# EAGLE schematic experimenter (EAGLE 9.6.2), part 2 of 2
## Sheet 1 of 2: NMOS Array (continued)
### Nets (continued)
N$308: JP69.2 R83.1
N$309: JN69.2 JS69.2 Q77.2(S) SOURCEA69.P1(S) SOURCEB69.P1(S)
N$311: DRAINA69.P1(S) DRAINB69.P1(S) JD68.1 JD69.2 JP69.1 JS85.1 Q77.3(D)
N$312: GATEA69.P1(S) GATEB69.P1(S) Q77.1(G)
N$313: JP70.2 R84.1
N$314: JN70.2 JS70.2 Q78.2(S) SOURCEA70.P1(S) SOURCEB70.P1(S)
N$315: DRAINA70.P1(S) DRAINB70.P1(S) JD69.1 JD70.2 JP70.1 JS86.1 Q78.3(D)
N$316: GATEA70.P1(S) GATEB70.P1(S) Q78.1(G)
N$317: JP71.2 R87.1
N$318: JN71.2 JS71.2 Q79.2(S) SOURCEA71.P1(S) SOURCEB71.P1(S)
N$319: DRAINA71.P1(S) DRAINB71.P1(S) JD70.1 JD71.2 JP71.1 JS87.1 Q79.3(D)
N$320: GATEA71.P1(S) GATEB71.P1(S) Q79.1(G)
N$323: JP72.2 R88.1
N$324: JN72.2 JS72.2 Q80.2(S) SOURCEA72.P1(S) SOURCEB72.P1(S)
N$325: DRAINA72.P1(S) DRAINB72.P1(S) JD71.1 JD72.2 JP72.1 JS88.1 Q80.3(D)
N$326: GATEA72.P1(S) GATEB72.P1(S) Q80.1(G)
N$327: JP73.2 R91.1
N$328: JN73.2 JS73.2 Q81.2(S) SOURCEA73.P1(S) SOURCEB73.P1(S)
N$329: DRAINA73.P1(S) DRAINB73.P1(S) JD72.1 JD73.2 JP73.1 JS89.1 Q81.3(D)
N$330: GATEA73.P1(S) GATEB73.P1(S) Q81.1(G)
N$331: JP74.2 R92.1
N$332: JN74.2 JS74.2 Q82.2(S) SOURCEA74.P1(S) SOURCEB74.P1(S)
N$333: DRAINA74.P1(S) DRAINB74.P1(S) JD73.1 JD74.2 JP74.1 JS90.1 Q82.3(D)
N$334: GATEA74.P1(S) GATEB74.P1(S) Q82.1(G)
N$335: JP75.2 R95.1
N$336: JN75.2 JS75.2 Q83.2(S) SOURCEA75.P1(S) SOURCEB75.P1(S)
N$337: DRAINA75.P1(S) DRAINB75.P1(S) JD74.1 JD75.2 JP75.1 JS91.1 Q83.3(D)
N$338: GATEA75.P1(S) GATEB75.P1(S) Q83.1(G)
N$339: JP76.2 R96.1
N$340: JN76.2 JS76.2 Q84.2(S) SOURCEA76.P1(S) SOURCEB76.P1(S)
N$341: DRAINA76.P1(S) DRAINB76.P1(S) JD75.1 JD76.2 JP76.1 JS92.1 Q84.3(D)
N$342: GATEA76.P1(S) GATEB76.P1(S) Q84.1(G)
N$343: JP77.2 R97.1
N$344: JN77.2 JS77.2 Q85.2(S) SOURCEA77.P1(S) SOURCEB77.P1(S)
N$345: DRAINA77.P1(S) DRAINB77.P1(S) JD76.1 JD77.2 JP77.1 JS93.1 Q85.3(D)
N$346: GATEA77.P1(S) GATEB77.P1(S) Q85.1(G)
N$347: JP78.2 R98.1
N$348: JN78.2 JS78.2 Q86.2(S) SOURCEA78.P1(S) SOURCEB78.P1(S)
N$349: DRAINA78.P1(S) DRAINB78.P1(S) JD77.1 JD78.2 JP78.1 JS94.1 Q86.3(D)
N$350: GATEA78.P1(S) GATEB78.P1(S) Q86.1(G)
N$351: JP79.2 R99.1
N$352: JN79.2 JS79.2 Q87.2(S) SOURCEA79.P1(S) SOURCEB79.P1(S)
N$353: DRAINA79.P1(S) DRAINB79.P1(S) JD78.1 JD79.2 JP79.1 JS95.1 Q87.3(D)
N$354: GATEA79.P1(S) GATEB79.P1(S) Q87.1(G)
N$355: JP80.2 R100.1
N$356: JN80.2 JS80.2 Q88.2(S) SOURCEA80.P1(S) SOURCEB80.P1(S)
N$357: DRAINA80.P1(S) DRAINB80.P1(S) JD79.1 JD80.2 JP80.1 JS96.1 Q88.3(D)
N$358: GATEA80.P1(S) GATEB80.P1(S) Q88.1(G)
N$359: JP81.2 R101.1
N$360: JN81.2 JS81.2 Q89.2(S) SOURCEA81.P1(S) SOURCEB81.P1(S)
N$361: DRAINA81.P1(S) DRAINB81.P1(S) JD81.2 JP81.1 JS97.1 Q89.3(D)
N$362: GATEA81.P1(S) GATEB81.P1(S) Q89.1(G)
N$363: JP82.2 R102.1
N$364: JN82.2 JS82.2 Q90.2(S) SOURCEA82.P1(S) SOURCEB82.P1(S)
N$365: DRAINA82.P1(S) DRAINB82.P1(S) JD81.1 JD82.2 JP82.1 JS98.1 Q90.3(D)
N$366: GATEA82.P1(S) GATEB82.P1(S) Q90.1(G)
N$367: JP83.2 R103.1
N$368: JN83.2 JS83.2 Q91.2(S) SOURCEA83.P1(S) SOURCEB83.P1(S)
N$369: DRAINA83.P1(S) DRAINB83.P1(S) JD82.1 JD83.2 JP83.1 JS99.1 Q91.3(D)
N$370: GATEA83.P1(S) GATEB83.P1(S) Q91.1(G)
N$371: JP84.2 R104.1
N$372: JN84.2 JS84.2 Q92.2(S) SOURCEA84.P1(S) SOURCEB84.P1(S)
N$373: DRAINA84.P1(S) DRAINB84.P1(S) JD83.1 JD84.2 JP84.1 JS100.1 Q92.3(D)
N$374: GATEA84.P1(S) GATEB84.P1(S) Q92.1(G)
N$375: JP85.2 R105.1
N$376: JN85.2 JS85.2 Q93.2(S) SOURCEA85.P1(S) SOURCEB85.P1(S)
N$377: DRAINA85.P1(S) DRAINB85.P1(S) JD84.1 JD85.2 JP85.1 JS101.1 Q93.3(D)
N$378: GATEA85.P1(S) GATEB85.P1(S) Q93.1(G)
N$379: JP86.2 R106.1
N$380: JN86.2 JS86.2 Q94.2(S) SOURCEA86.P1(S) SOURCEB86.P1(S)
N$381: DRAINA86.P1(S) DRAINB86.P1(S) JD85.1 JD86.2 JP86.1 JS102.1 Q94.3(D)
N$382: GATEA86.P1(S) GATEB86.P1(S) Q94.1(G)
N$383: JP87.2 R107.1
N$384: JN87.2 JS87.2 Q95.2(S) SOURCEA87.P1(S) SOURCEB87.P1(S)
N$385: DRAINA87.P1(S) DRAINB87.P1(S) JD86.1 JD87.2 JP87.1 JS103.1 Q95.3(D)
N$386: GATEA87.P1(S) GATEB87.P1(S) Q95.1(G)
N$387: JP88.2 R108.1
N$388: JN88.2 JS88.2 Q96.2(S) SOURCEA88.P1(S) SOURCEB88.P1(S)
N$389: DRAINA88.P1(S) DRAINB88.P1(S) JD87.1 JD88.2 JP88.1 JS104.1 Q96.3(D)
N$390: GATEA88.P1(S) GATEB88.P1(S) Q96.1(G)
N$391: JP89.2 R109.1
N$392: JN89.2 JS89.2 Q97.2(S) SOURCEA89.P1(S) SOURCEB89.P1(S)
N$393: DRAINA89.P1(S) DRAINB89.P1(S) JD88.1 JD89.2 JP89.1 JS105.1 Q97.3(D)
N$394: GATEA89.P1(S) GATEB89.P1(S) Q97.1(G)
N$395: JP90.2 R110.1
N$396: JN90.2 JS90.2 Q98.2(S) SOURCEA90.P1(S) SOURCEB90.P1(S)
N$397: DRAINA90.P1(S) DRAINB90.P1(S) JD89.1 JD90.2 JP90.1 JS106.1 Q98.3(D)
N$398: GATEA90.P1(S) GATEB90.P1(S) Q98.1(G)
N$399: JP91.2 R111.1
N$400: JN91.2 JS91.2 Q99.2(S) SOURCEA91.P1(S) SOURCEB91.P1(S)
N$401: DRAINA91.P1(S) DRAINB91.P1(S) JD90.1 JD91.2 JP91.1 JS107.1 Q99.3(D)
N$402: GATEA91.P1(S) GATEB91.P1(S) Q99.1(G)
N$403: JP92.2 R112.1
N$404: JN92.2 JS92.2 Q100.2(S) SOURCEA92.P1(S) SOURCEB92.P1(S)
N$405: DRAINA92.P1(S) DRAINB92.P1(S) JD91.1 JD92.2 JP92.1 JS108.1 Q100.3(D)
N$406: GATEA92.P1(S) GATEB92.P1(S) Q100.1(G)
N$407: JP93.2 R113.1
N$408: JN93.2 JS93.2 Q101.2(S) SOURCEA93.P1(S) SOURCEB93.P1(S)
N$409: DRAINA93.P1(S) DRAINB93.P1(S) JD92.1 JD93.2 JP93.1 JS109.1 Q101.3(D)
N$410: GATEA93.P1(S) GATEB93.P1(S) Q101.1(G)
N$411: JP94.2 R114.1
N$412: JN94.2 JS94.2 Q102.2(S) SOURCEA94.P1(S) SOURCEB94.P1(S)
N$413: DRAINA94.P1(S) DRAINB94.P1(S) JD93.1 JD94.2 JP94.1 JS110.1 Q102.3(D)
N$414: GATEA94.P1(S) GATEB94.P1(S) Q102.1(G)
N$415: JP95.2 R115.1
N$416: JN95.2 JS95.2 Q103.2(S) SOURCEA95.P1(S) SOURCEB95.P1(S)
N$417: DRAINA95.P1(S) DRAINB95.P1(S) JD94.1 JD95.2 JP95.1 JS111.1 Q103.3(D)
N$418: GATEA95.P1(S) GATEB95.P1(S) Q103.1(G)
N$419: JP96.2 R116.1
N$420: JN96.2 JS96.2 Q104.2(S) SOURCEA96.P1(S) SOURCEB96.P1(S)
N$421: DRAINA96.P1(S) DRAINB96.P1(S) JD95.1 JD96.2 JP96.1 JS112.1 Q104.3(D)
N$422: GATEA96.P1(S) GATEB96.P1(S) Q104.1(G)
N$423: JP97.2 R117.1
N$424: JN97.2 JS97.2 Q105.2(S) SOURCEA97.P1(S) SOURCEB97.P1(S)
N$425: DRAINA97.P1(S) DRAINB97.P1(S) JD97.2 JP97.1 Q105.3(D)
N$426: GATEA97.P1(S) GATEB97.P1(S) Q105.1(G)
N$427: JP98.2 R118.1
N$428: JN98.2 JS98.2 Q106.2(S) SOURCEA98.P1(S) SOURCEB98.P1(S)
N$429: DRAINA98.P1(S) DRAINB98.P1(S) JD97.1 JD98.2 JP98.1 Q106.3(D)
N$430: GATEA98.P1(S) GATEB98.P1(S) Q106.1(G)
N$431: JP99.2 R119.1
N$432: JN99.2 JS99.2 Q107.2(S) SOURCEA99.P1(S) SOURCEB99.P1(S)
N$433: DRAINA99.P1(S) DRAINB99.P1(S) JD98.1 JD99.2 JP99.1 Q107.3(D)
N$434: GATEA99.P1(S) GATEB99.P1(S) Q107.1(G)
N$435: JP100.2 R120.1
N$436: JN100.2 JS100.2 Q108.2(S) SOURCEA100.P1(S) SOURCEB100.P1(S)
N$437: DRAINA100.P1(S) DRAINB100.P1(S) JD99.1 JD100.2 JP100.1 Q108.3(D)
N$438: GATEA100.P1(S) GATEB100.P1(S) Q108.1(G)
N$439: JP101.2 R121.1
N$440: JN101.2 JS101.2 Q109.2(S) SOURCEA101.P1(S) SOURCEB101.P1(S)
N$441: DRAINA101.P1(S) DRAINB101.P1(S) JD100.1 JD101.2 JP101.1 Q109.3(D)
N$442: GATEA101.P1(S) GATEB101.P1(S) Q109.1(G)
N$443: JP102.2 R122.1
N$444: JN102.2 JS102.2 Q110.2(S) SOURCEA102.P1(S) SOURCEB102.P1(S)
N$445: DRAINA102.P1(S) DRAINB102.P1(S) JD101.1 JD102.2 JP102.1 Q110.3(D)
N$446: GATEA102.P1(S) GATEB102.P1(S) Q110.1(G)
N$447: JP103.2 R123.1
N$448: JN103.2 JS103.2 Q111.2(S) SOURCEA103.P1(S) SOURCEB103.P1(S)
N$449: DRAINA103.P1(S) DRAINB103.P1(S) JD102.1 JD103.2 JP103.1 Q111.3(D)
N$450: GATEA103.P1(S) GATEB103.P1(S) Q111.1(G)
N$451: JP104.2 R124.1
N$452: JN104.2 JS104.2 Q112.2(S) SOURCEA104.P1(S) SOURCEB104.P1(S)
N$453: DRAINA104.P1(S) DRAINB104.P1(S) JD103.1 JD104.2 JP104.1 Q112.3(D)
N$454: GATEA104.P1(S) GATEB104.P1(S) Q112.1(G)
N$455: JP105.2 R125.1
N$456: JN105.2 JS105.2 Q113.2(S) SOURCEA105.P1(S) SOURCEB105.P1(S)
N$457: DRAINA105.P1(S) DRAINB105.P1(S) JD104.1 JD105.2 JP105.1 Q113.3(D)
N$458: GATEA105.P1(S) GATEB105.P1(S) Q113.1(G)
N$459: JP106.2 R126.1
N$460: JN106.2 JS106.2 Q114.2(S) SOURCEA106.P1(S) SOURCEB106.P1(S)
N$461: DRAINA106.P1(S) DRAINB106.P1(S) JD105.1 JD106.2 JP106.1 Q114.3(D)
N$462: GATEA106.P1(S) GATEB106.P1(S) Q114.1(G)
N$463: JP107.2 R127.1
N$464: JN107.2 JS107.2 Q115.2(S) SOURCEA107.P1(S) SOURCEB107.P1(S)
N$465: DRAINA107.P1(S) DRAINB107.P1(S) JD106.1 JD107.2 JP107.1 Q115.3(D)
N$466: GATEA107.P1(S) GATEB107.P1(S) Q115.1(G)
N$467: JP108.2 R128.1
N$468: JN108.2 JS108.2 Q116.2(S) SOURCEA108.P1(S) SOURCEB108.P1(S)
N$469: DRAINA108.P1(S) DRAINB108.P1(S) JD107.1 JD108.2 JP108.1 Q116.3(D)
N$470: GATEA108.P1(S) GATEB108.P1(S) Q116.1(G)
N$471: JP109.2 R129.1
N$472: JN109.2 JS109.2 Q117.2(S) SOURCEA109.P1(S) SOURCEB109.P1(S)
N$473: DRAINA109.P1(S) DRAINB109.P1(S) JD108.1 JD109.2 JP109.1 Q117.3(D)
N$474: GATEA109.P1(S) GATEB109.P1(S) Q117.1(G)
N$475: JP110.2 R130.1
N$476: JN110.2 JS110.2 Q118.2(S) SOURCEA110.P1(S) SOURCEB110.P1(S)
N$477: DRAINA110.P1(S) DRAINB110.P1(S) JD109.1 JD110.2 JP110.1 Q118.3(D)
N$478: GATEA110.P1(S) GATEB110.P1(S) Q118.1(G)
N$479: JP111.2 R131.1
N$480: JN111.2 JS111.2 Q119.2(S) SOURCEA111.P1(S) SOURCEB111.P1(S)
N$481: DRAINA111.P1(S) DRAINB111.P1(S) JD110.1 JD111.2 JP111.1 Q119.3(D)
N$482: GATEA111.P1(S) GATEB111.P1(S) Q119.1(G)
N$483: JP112.2 R132.1
N$484: JN112.2 JS112.2 Q120.2(S) SOURCEA112.P1(S) SOURCEB112.P1(S)
N$485: DRAINA112.P1(S) DRAINB112.P1(S) JD111.1 JD112.2 JP112.1 Q120.3(D)
N$486: GATEA112.P1(S) GATEB112.P1(S) Q120.1(G)
VCC: R25.2 R26.2 R27.2 R28.2 R29.2 R30.2 R31.2 R32.2 R33.2 R34.2 R35.2 R36.2 R37.2 R38.2 R39.2 R40.2 R41.2 R42.2 R43.2 R44.2 R45.2 R46.2 R47.2 R48.2 R49.2 R50.2 R51.2 R52.2 R53.2 R54.2 R55.2 R56.2 R57.2 R58.2 R59.2 R60.2 R61.2 R62.2 R63.2 R64.2 R65.2 R66.2 R67.2 R68.2 R69.2 R70.2 R71.2 R72.2 R73.2 R74.2 R79.2 R80.2 R83.2 R84.2 R87.2 R88.2 R91.2 R92.2 R95.2 R96.2 R97.2 R98.2 R99.2 R100.2 R101.2 R102.2 R103.2 R104.2 R105.2 R106.2 R107.2 R108.2 R109.2 R110.2 R111.2 R112.2 R113.2 R114.2 R115.2 R116.2 R117.2 R118.2 R119.2 R120.2 R121.2 R122.2 R123.2 R124.2 R125.2 R126.2 R127.2 R128.2 R129.2 R130.2 R131.2 R132.2 ; also sheet 2
Unconnected: JD32.1 JD48.1 JD64.1 JD80.1 JD96.1 JD112.1 JS33.1 JS34.1 JS35.1 JS36.1 JS37.1 JS38.1 JS39.1 JS40.1 JS41.1 JS42.1 JS43.1 JS44.1 JS45.1 JS46.1 JS47.1 JS48.1

### Notes on the sheet
- NMOS Logic
  Transistor Cell
- NMOS Logic
  Transistor Cell
- NMOS Logic
  Transistor Cell
- NMOS Logic
  Transistor Cell
- NMOS Logic
  Transistor Cell
- NMOS Logic
  Transistor Cell
- NMOS Logic
  Transistor Cell
- NMOS Logic
  Transistor Cell
- NMOS Logic
  Transistor Cell
- NMOS Logic
  Transistor Cell
- NMOS Logic
  Transistor Cell
- NMOS Logic
  Transistor Cell
- NMOS Logic
  Transistor Cell
- NMOS Logic
  Transistor Cell
- NMOS Logic
  Transistor Cell
- NMOS Logic
  Transistor Cell
- NMOS Logic
  Transistor Cell
- NMOS Logic
  Transistor Cell
- NMOS Logic
  Transistor Cell
- NMOS Logic
  Transistor Cell
- NMOS Logic
  Transistor Cell
- NMOS Logic
  Transistor Cell
- NMOS Logic
  Transistor Cell
- NMOS Logic
  Transistor Cell
- NMOS Logic
  Transistor Cell
- NMOS Logic
  Transistor Cell
- NMOS Logic
  Transistor Cell
- NMOS Logic
  Transistor Cell
- NMOS Logic
  Transistor Cell
- NMOS Logic
  Transistor Cell
- NMOS Logic
  Transistor Cell
- NMOS Logic
  Transistor Cell
- NMOS Logic
  Transistor Cell
- NMOS Logic
  Transistor Cell
- NMOS Logic
  Transistor Cell
- NMOS Logic
  Transistor Cell
- NMOS Logic
  Transistor Cell
- NMOS Logic
  Transistor Cell
- NMOS Logic
  Transistor Cell
- NMOS Logic
  Transistor Cell
- NMOS Logic
  Transistor Cell
- NMOS Logic
  Transistor Cell
- NMOS Logic
  Transistor Cell
- NMOS Logic
  Transistor Cell
- NMOS Logic
  Transistor Cell
- NMOS Logic
  Transistor Cell
- NMOS Logic
  Transistor Cell
- NMOS Logic
  Transistor Cell
- NMOS Logic
  Transistor Cell
- NMOS Logic
  Transistor Cell
- NMOS Logic
  Transistor Cell
- NMOS Logic
  Transistor Cell
- NMOS Logic
  Transistor Cell
- NMOS Logic
  Transistor Cell
- NMOS Logic
  Transistor Cell
- NMOS Logic
  Transistor Cell
- NMOS Logic
  Transistor Cell
- NMOS Logic
  Transistor Cell
- NMOS Logic
  Transistor Cell
- NMOS Logic
  Transistor Cell
- NMOS Logic
  Transistor Cell
- NMOS Logic
  Transistor Cell
- NMOS Logic
  Transistor Cell
- NMOS Logic
  Transistor Cell
- NMOS Logic
  Transistor Cell
- NMOS Logic
  Transistor Cell
- NMOS Logic
  Transistor Cell
- NMOS Logic
  Transistor Cell
- NMOS Logic
  Transistor Cell
- NMOS Logic
  Transistor Cell
- NMOS Logic
  Transistor Cell
- NMOS Logic
  Transistor Cell
- NMOS Logic
  Transistor Cell
- NMOS Logic
  Transistor Cell
- NMOS Logic
  Transistor Cell
- NMOS Logic
  Transistor Cell
- NMOS Logic
  Transistor Cell
- NMOS Logic
  Transistor Cell
- NMOS Logic
  Transistor Cell
- NMOS Logic
  Transistor Cell
- NMOS Logic
  Transistor Cell
- NMOS Logic
  Transistor Cell
- NMOS Logic
  Transistor Cell
- NMOS Logic
  Transistor Cell
- NMOS Logic
  Transistor Cell
- NMOS Logic
  Transistor Cell
- NMOS Logic
  Transistor Cell
- NMOS Logic
  Transistor Cell
- NMOS Logic
  Transistor Cell
- NMOS Logic
  Transistor Cell
- NMOS Logic
  Transistor Cell
- NMOS Logic
  Transistor Cell
- NMOS Logic
  Transistor Cell
- NMOS Logic
  Transistor Cell
- NMOS Logic
  Transistor Cell
- NMOS Logic
  Transistor Cell

## Sheet 2 of 2: Buttons, Switches, LEDs, Power
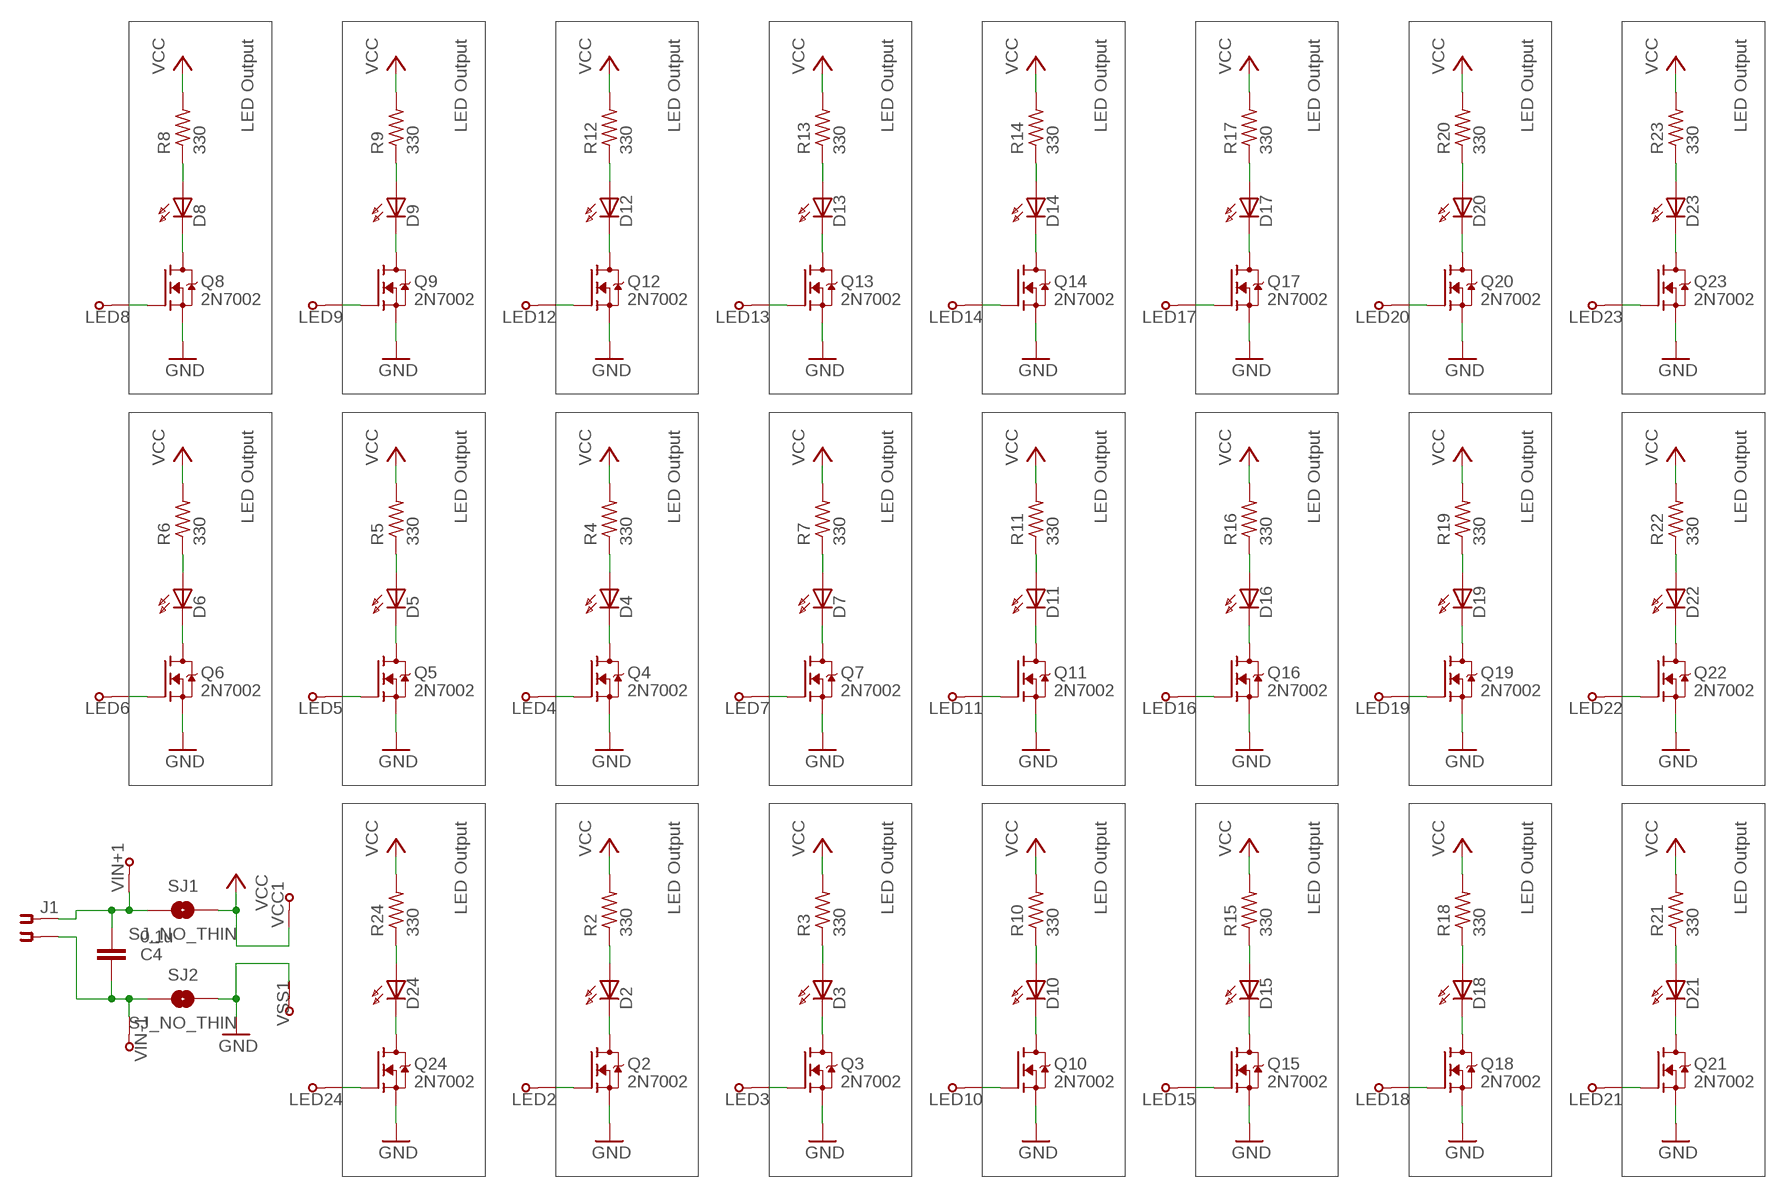
[diagram p2: schematic, sheet 2]

### Parts
C4  0.1u  CAP0603  [C0603]
D2  LED0603  [CHIP-LED0603]
D3  LED0603  [CHIP-LED0603]
D4  LED0603  [CHIP-LED0603]
D5  LED0603  [CHIP-LED0603]
D6  LED0603  [CHIP-LED0603]
D7  LED0603  [CHIP-LED0603]
D8  LED0603  [CHIP-LED0603]
D9  LED0603  [CHIP-LED0603]
D10  LED0603  [CHIP-LED0603]
D11  LED0603  [CHIP-LED0603]
D12  LED0603  [CHIP-LED0603]
D13  LED0603  [CHIP-LED0603]
D14  LED0603  [CHIP-LED0603]
D15  LED0603  [CHIP-LED0603]
D16  LED0603  [CHIP-LED0603]
D17  LED0603  [CHIP-LED0603]
D18  LED0603  [CHIP-LED0603]
D19  LED0603  [CHIP-LED0603]
D20  LED0603  [CHIP-LED0603]
D21  LED0603  [CHIP-LED0603]
D22  LED0603  [CHIP-LED0603]
D23  LED0603  [CHIP-LED0603]
D24  LED0603  [CHIP-LED0603]
J1  CON-F-2SCREWTERM-0.1"  [OSTVN02A150]
LED2  TPTHT  [PROTOPAD-THT-PAD]
LED3  TPTHT  [PROTOPAD-THT-PAD]
LED4  TPTHT  [PROTOPAD-THT-PAD]
LED5  TPTHT  [PROTOPAD-THT-PAD]
LED6  TPTHT  [PROTOPAD-THT-PAD]
LED7  TPTHT  [PROTOPAD-THT-PAD]
LED8  TPTHT  [PROTOPAD-THT-PAD]
LED9  TPTHT  [PROTOPAD-THT-PAD]
LED10  TPTHT  [PROTOPAD-THT-PAD]
LED11  TPTHT  [PROTOPAD-THT-PAD]
LED12  TPTHT  [PROTOPAD-THT-PAD]
LED13  TPTHT  [PROTOPAD-THT-PAD]
LED14  TPTHT  [PROTOPAD-THT-PAD]
LED15  TPTHT  [PROTOPAD-THT-PAD]
LED16  TPTHT  [PROTOPAD-THT-PAD]
LED17  TPTHT  [PROTOPAD-THT-PAD]
LED18  TPTHT  [PROTOPAD-THT-PAD]
LED19  TPTHT  [PROTOPAD-THT-PAD]
LED20  TPTHT  [PROTOPAD-THT-PAD]
LED21  TPTHT  [PROTOPAD-THT-PAD]
LED22  TPTHT  [PROTOPAD-THT-PAD]
LED23  TPTHT  [PROTOPAD-THT-PAD]
LED24  TPTHT  [PROTOPAD-THT-PAD]
Q2  2N7002  [SOT23]
Q3  2N7002  [SOT23]
Q4  2N7002  [SOT23]
Q5  2N7002  [SOT23]
Q6  2N7002  [SOT23]
Q7  2N7002  [SOT23]
Q8  2N7002  [SOT23]
Q9  2N7002  [SOT23]
Q10  2N7002  [SOT23]
Q11  2N7002  [SOT23]
Q12  2N7002  [SOT23]
Q13  2N7002  [SOT23]
Q14  2N7002  [SOT23]
Q15  2N7002  [SOT23]
Q16  2N7002  [SOT23]
Q17  2N7002  [SOT23]
Q18  2N7002  [SOT23]
Q19  2N7002  [SOT23]
Q20  2N7002  [SOT23]
Q21  2N7002  [SOT23]
Q22  2N7002  [SOT23]
Q23  2N7002  [SOT23]
Q24  2N7002  [SOT23]
R2  330  RES0603  [R0603]
R3  330  RES0603  [R0603]
R4  330  RES0603  [R0603]
R5  330  RES0603  [R0603]
R6  330  RES0603  [R0603]
R7  330  RES0603  [R0603]
R8  330  RES0603  [R0603]
R9  330  RES0603  [R0603]
R10  330  RES0603  [R0603]
R11  330  RES0603  [R0603]
R12  330  RES0603  [R0603]
R13  330  RES0603  [R0603]
R14  330  RES0603  [R0603]
R15  330  RES0603  [R0603]
R16  330  RES0603  [R0603]
R17  330  RES0603  [R0603]
R18  330  RES0603  [R0603]
R19  330  RES0603  [R0603]
R20  330  RES0603  [R0603]
R21  330  RES0603  [R0603]
R22  330  RES0603  [R0603]
R23  330  RES0603  [R0603]
R24  330  RES0603  [R0603]
SJ1  SJ_NO_THIN  [SJ_2S-NO-THIN]
SJ2  SJ_NO_THIN  [SJ_2S-NO-THIN]
VCC1  TPTHT  [PROTOPAD-THT-PAD]
VIN+1  TPTHT  [PROTOPAD-THT-PAD]
VIN-1  TPTHT  [PROTOPAD-THT-PAD]
VSS1  TPTHT  [PROTOPAD-THT-PAD]

### Nets
GND: Q2.2(S) Q3.2(S) Q4.2(S) Q5.2(S) Q6.2(S) Q7.2(S) Q8.2(S) Q9.2(S) Q10.2(S) Q11.2(S) Q12.2(S) Q13.2(S) Q14.2(S) Q15.2(S) Q16.2(S) Q17.2(S) Q18.2(S) Q19.2(S) Q20.2(S) Q21.2(S) Q22.2(S) Q23.2(S) Q24.2(S) SJ2.2 VSS1.P1(S) ; also sheet 1
N$2: D10.A R10.1
N$3: LED10.P1(S) Q10.1(G)
N$4: D2.A R2.1
N$6: D10.C(K) Q10.3(D)
N$7: LED2.P1(S) Q2.1(G)
N$9: D2.C(K) Q2.3(D)
N$10: D3.A R3.1
N$11: LED3.P1(S) Q3.1(G)
N$12: D3.C(K) Q3.3(D)
N$13: D4.A R4.1
N$14: LED4.P1(S) Q4.1(G)
N$15: D4.C(K) Q4.3(D)
N$16: D5.A R5.1
N$17: LED5.P1(S) Q5.1(G)
N$18: D5.C(K) Q5.3(D)
N$19: D6.A R6.1
N$20: LED6.P1(S) Q6.1(G)
N$21: D6.C(K) Q6.3(D)
N$22: D7.A R7.1
N$23: LED7.P1(S) Q7.1(G)
N$24: D7.C(K) Q7.3(D)
N$25: D8.A R8.1
N$26: LED8.P1(S) Q8.1(G)
N$27: D8.C(K) Q8.3(D)
N$28: D9.A R9.1
N$29: LED9.P1(S) Q9.1(G)
N$30: D9.C(K) Q9.3(D)
N$31: D11.A R11.1
N$32: LED11.P1(S) Q11.1(G)
N$33: D11.C(K) Q11.3(D)
N$34: D12.A R12.1
N$35: LED12.P1(S) Q12.1(G)
N$36: D12.C(K) Q12.3(D)
N$37: D13.A R13.1
N$38: LED13.P1(S) Q13.1(G)
N$39: D13.C(K) Q13.3(D)
N$40: D14.A R14.1
N$41: LED14.P1(S) Q14.1(G)
N$42: D14.C(K) Q14.3(D)
N$43: D15.A R15.1
N$44: LED15.P1(S) Q15.1(G)
N$45: D15.C(K) Q15.3(D)
N$46: D16.A R16.1
N$47: LED16.P1(S) Q16.1(G)
N$48: D16.C(K) Q16.3(D)
N$49: D17.A R17.1
N$50: LED17.P1(S) Q17.1(G)
N$51: D17.C(K) Q17.3(D)
N$52: D18.A R18.1
N$53: LED18.P1(S) Q18.1(G)
N$54: D18.C(K) Q18.3(D)
N$55: D19.A R19.1
N$56: LED19.P1(S) Q19.1(G)
N$57: D19.C(K) Q19.3(D)
N$58: D20.A R20.1
N$59: LED20.P1(S) Q20.1(G)
N$60: D20.C(K) Q20.3(D)
N$61: D21.A R21.1
N$62: LED21.P1(S) Q21.1(G)
N$63: D21.C(K) Q21.3(D)
N$64: D22.A R22.1
N$65: LED22.P1(S) Q22.1(G)
N$66: D22.C(K) Q22.3(D)
N$67: D23.A R23.1
N$68: LED23.P1(S) Q23.1(G)
N$69: D23.C(K) Q23.3(D)
N$70: D24.A R24.1
N$71: LED24.P1(S) Q24.1(G)
N$72: D24.C(K) Q24.3(D)
N$321: C4.1 J1.P$2(S1) SJ2.1 VIN-1.P1(S)
N$322: C4.2 J1.P$1(S) SJ1.1 VIN+1.P1(S)
VCC: R2.2 R3.2 R4.2 R5.2 R6.2 R7.2 R8.2 R9.2 R10.2 R11.2 R12.2 R13.2 R14.2 R15.2 R16.2 R17.2 R18.2 R19.2 R20.2 R21.2 R22.2 R23.2 R24.2 SJ1.2 VCC1.P1(S) ; also sheet 1

### Notes on the sheet
- LED Output | LED Output | LED Output | LED Output | LED Output | LED Output | LED Output | LED Output
- LED Output | LED Output | LED Output | LED Output | LED Output | LED Output | LED Output | LED Output
- LED Output | LED Output | LED Output | LED Output | LED Output | LED Output | LED Output

## Library data of the parts
C4 = ellajameson-core:CAP
D2-D24 = ellajameson-core:LED
DRAINA2-DRAINA5 DRAINA21-DRAINA112 DRAINB2-DRAINB5 DRAINB21-DRAINB112 GATEA2-GATEA5 GATEA21-GATEA112 GATEB2-GATEB5 GATEB21-GATEB112 LED2-LED24 SOURCEA2-SOURCEA5 SOURCEA21-SOURCEA112 SOURCEB2-SOURCEB5 SOURCEB21-SOURCEB112 VCC1 VIN+1 VIN-1 VSS1 = ellajameson-core:TP
J1 = ellajameson-core:CON-F-2
JD2-JD5 JD21-JD112 JN2-JN5 JN21-JN112 JP2-JP5 JP21-JP112 JS2-JS5 JS21-JS112 SJ1 SJ2 = ellajameson-core:SJ: Solder Jumper Standard SMD solder jumper. Used to automate production. Two varients : Normally Open and Normally Closed are the same, but have different paste layers. NC will have a large amount of paste and should jumper during reflow.
Q2-Q120 = ellajameson-core:2N7002
R2-R74 R79 R80 R83 R84 R87 R88 R91 R92 R95-R132 = ellajameson-core:RES